# EasyEDA Pro project ProPrj_补光灯_2024-08-31.epro

# Schematic Schematic1
Create Date: 2024-07-06; Page Name: P1; Project Name: 补光灯; Schematic Name: Schematic1; Update Date: 2024-07-06; Company: 嘉立创EDA; Page Size: A4; Version: V1.0
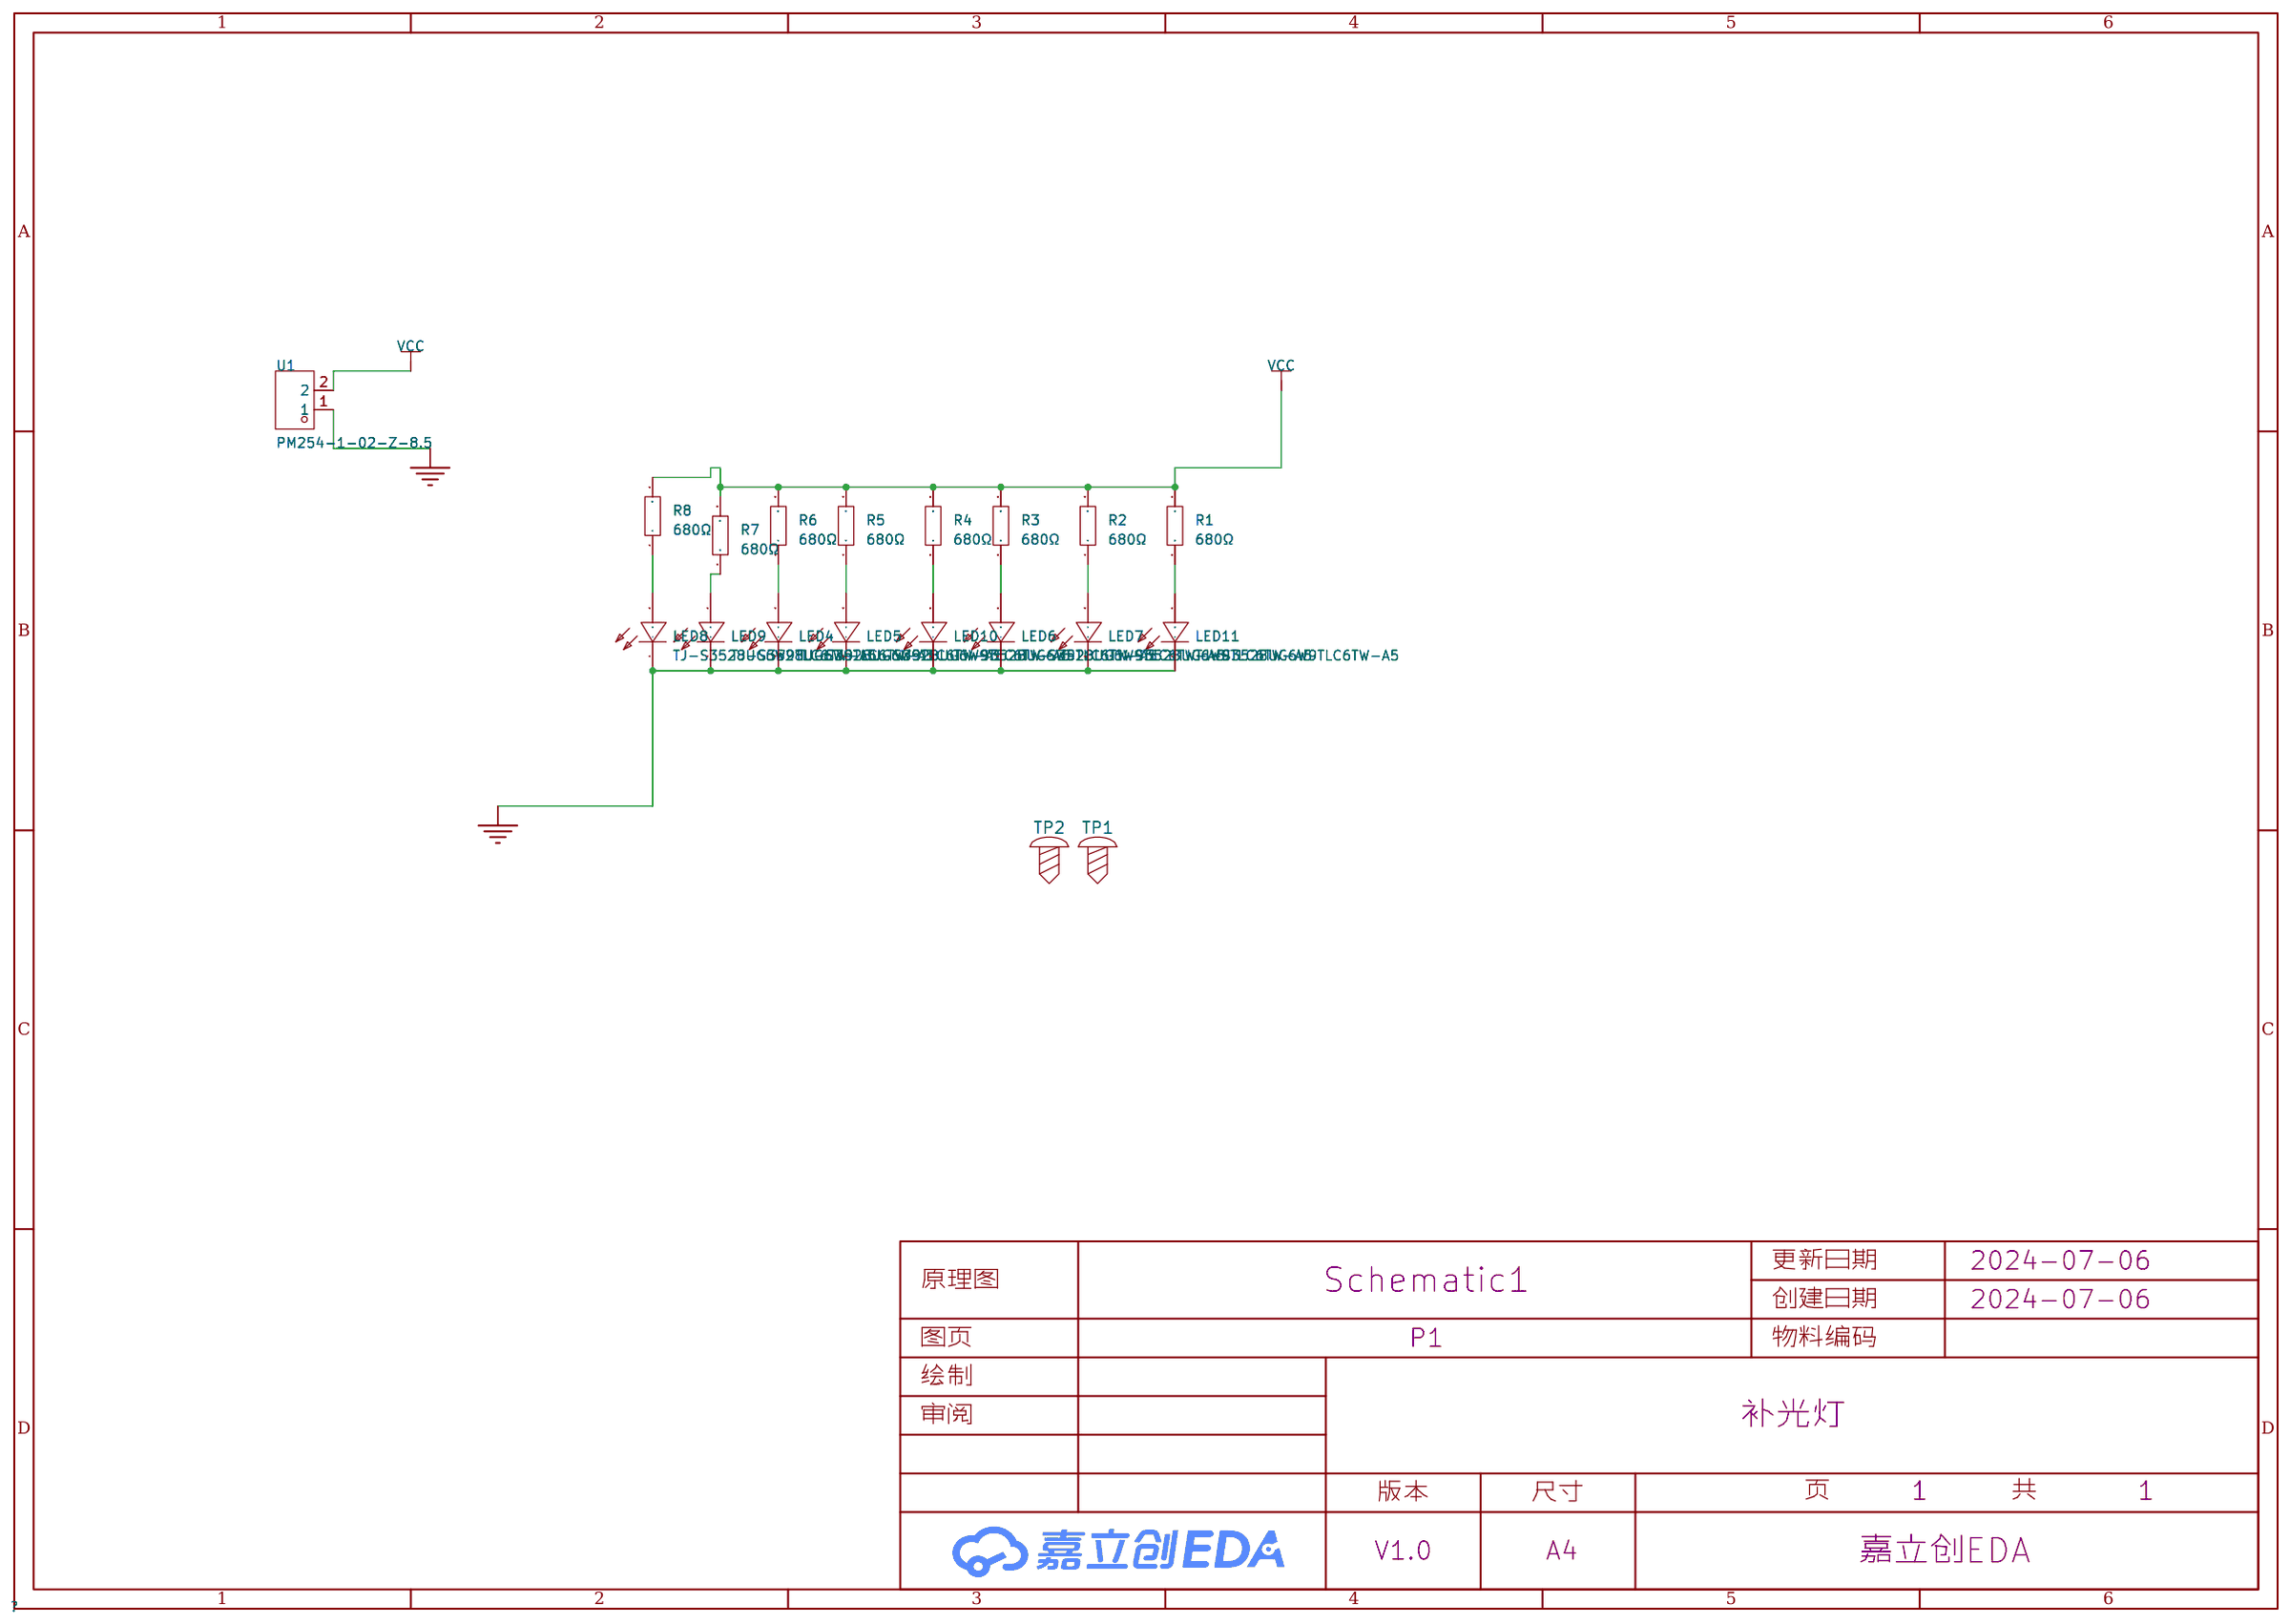
[diagram p0: schematic sheet]

## Parts
LED4  TJ-S3528UG6W9TLC6TW-A5  [LED-SMD_L3.2-W2.8-R-RD]
LED5  TJ-S3528UG6W9TLC6TW-A5  [LED-SMD_L3.2-W2.8-R-RD]
LED6  TJ-S3528UG6W9TLC6TW-A5  [LED-SMD_L3.2-W2.8-R-RD]
LED7  TJ-S3528UG6W9TLC6TW-A5  [LED-SMD_L3.2-W2.8-R-RD]
LED8  TJ-S3528UG6W9TLC6TW-A5  [LED-SMD_L3.2-W2.8-R-RD]
LED9  TJ-S3528UG6W9TLC6TW-A5  [LED-SMD_L3.2-W2.8-R-RD]
LED10  TJ-S3528UG6W9TLC6TW-A5  [LED-SMD_L3.2-W2.8-R-RD]
LED11  TJ-S3528UG6W9TLC6TW-A5  [LED-SMD_L3.2-W2.8-R-RD]
R1  680Ω  [R0805]
R2  680Ω  [R0805]
R3  680Ω  [R0805]
R4  680Ω  [R0805]
R5  680Ω  [R0805]
R6  680Ω  [R0805]
R7  680Ω  [R0805]
R8  680Ω  [R0805]
TP1  M3铜柱带丝印  [M3铜柱]
TP2  M3铜柱带丝印  [M3铜柱]
U1  PM254-1-02-Z-8.5  [HDR-TH_2P-P2.54-V-F]

## Library data of the parts
LED4-LED11 = TJ-S3528UG6W9TLC6TW-A5: 发光颜色:白色;功率:108mW;正向电流:20mA;主波长:-;二极管配置:-;透镜颜色:-;色温:5500K~7000K;发光角度:120°;载带方式:-;工作温度:-40℃~+80℃;; LCSC Part Name: 白灯 色温5500K~7000K; Supplier Part: C440446; Manufacturer: TOGIALED(统佳); Supplier Footprint: SMD3528; JLCPCB Part Class: 扩展库; Datasheet: https://atta.szlcsc.com/upload/public/pdf/source/20191029/C440446_C922C7169113DF60423DD98CE29B74FA.pdf; Supplier: LCSC; Emitted Color: 白色; Power Dissipation: 108mW; Forward Current: 20mA; Color Temperature: 5500K~7000K; Viewing Angle: 120°; Operating Temperature: -40℃~+80℃
R1-R8 = 0805W8F6800T5E: 电阻类型:厚膜电阻;阻值:680Ω;精度:±1%;功率:125mW;最大工作电压:150V;温度系数:±100ppm/℃;; LCSC Part Name: 680Ω ±1% 125mW 厚膜电阻; Supplier Part: C17798; Manufacturer: UNI-ROYAL(厚声); Supplier Footprint: 0805; JLCPCB Part Class: 基础库; Datasheet: https://atta.szlcsc.com/upload/public/pdf/source/20200306/C422600_1E6D84923E4A46A82E41ADD87F860B5C.pdf; Supplier: LCSC; Type: 厚膜电阻; Tolerance: ±1%; Power(Watts): 125mW; Overload Voltage (Max): 150V; Temperature Coefficient: ±100ppm/℃; Operating Temperature Range: -55℃~+155℃
TP1 TP2 = M3铜柱带丝印: Check: false
U1 = PM254-1-02-Z-8.5: 插孔结构:1x2P;间距:2.54mm;行距:-;圆孔/方孔:方孔;安装类型:直插;排数:单排;总孔位数:2P;额定电流:3A;额定电压:-;插孔方向:顶部;塑高:8.5mm;触头材质:铜合金;工作温度范围:-40℃~+105℃;焊接温度(最大值):260℃@5S;; LCSC Part Name: 1x2P 间距:2.54mm 直插; Supplier Part: C2897365; Manufacturer: HCTL(华灿天禄); Supplier Footprint: 插件,P=2.54mm; Datasheet: https://atta.szlcsc.com/upload/public/pdf/source/20230609/534BE42964C679BDE98E061007C4ABD6.pdf; Supplier: LCSC; Holes Structure: 1x2P; Pitch: 2.54mm; Circular Hole / Square Hole: 方孔; Mounting Type: 直插; Number of Rows: 单排; Number of Holes: 2P; Current Rating (Max): 3A; Holes Direction: 顶部; Insulation Height: 8.5mm; Contact Material: 铜合金; Operating Temperature Range: -40℃~+105℃; Soldering Temperature(Max): 260℃@5S

## Nets
GND: LED4.1(-) LED5.1(-) LED6.1(-) LED7.1(-) LED8.1(-) LED9.1(-) LED10.1(-) LED11.1(-) U1.1
VCC: R1.2 R2.2 R3.2 R4.2 R5.2 R6.2 R7.2 R8.2 U1.2
$1N1344: LED8.2(+) R8.1
$1N1355: LED4.2(+) R6.1
$1N1356: LED9.2(+) R7.1
$1N1361: LED5.2(+) R5.1
$1N1364: LED10.2(+) R4.1
$1N1370: LED6.2(+) R3.1
$1N1376: LED7.2(+) R2.1
$1N1379: LED11.2(+) R1.1

# Board PCB1
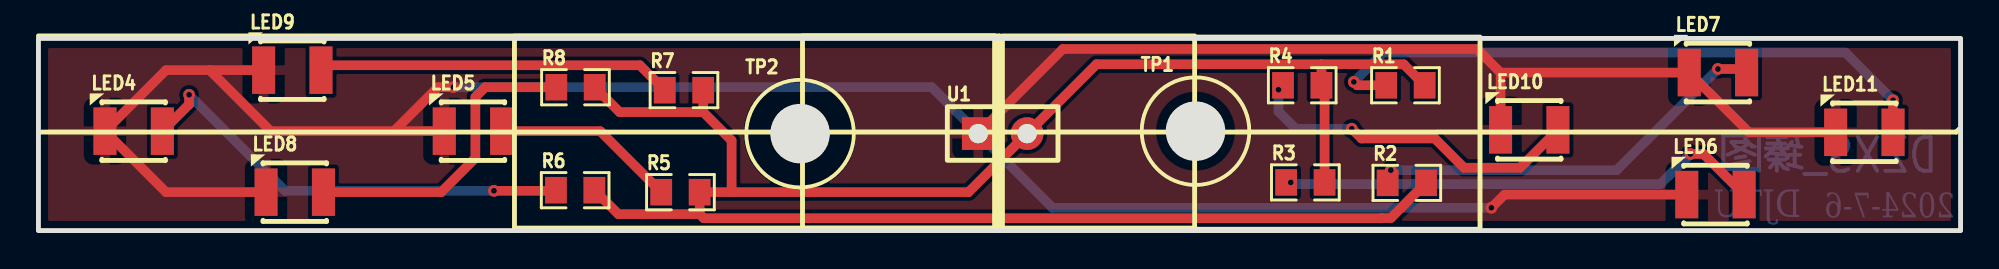
[diagram p1: board, top side]
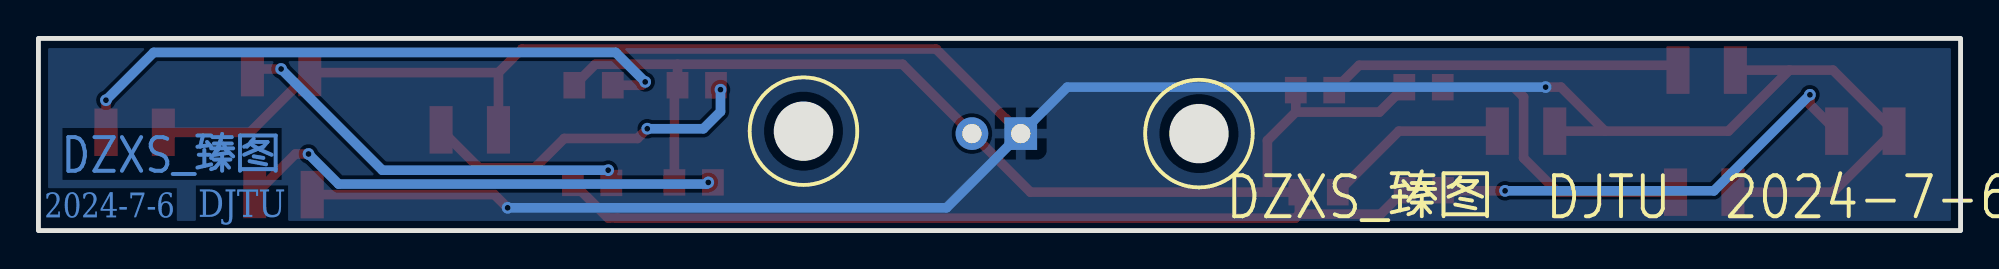
[diagram p2: board, bottom side, seen from below]

Outline 100 x 10 mm; copper layers: Top Layer, Bottom Layer. Coordinates in mm from the lower left corner of the outline.
Outline path: rectangle 0,10 100,0
Stack: Top Layer 0.035mm / Dielectric1 1.51mm FR4 er 4.5 / Bottom Layer 0.035mm

## Design rules (mm)
template: 自定义配置
spacing copperThickness1oz (default): track to track 0.102, other pairs 0.152 to 0.3
spacing copperThickness2oz: track to track 0.203, other pairs 0.152 to 0.3
track width copperThickness1oz (default): min 0.127, default 0.254, max 2.54
track width copperThickness2oz: min 0.203, default 0.254, max 2.54
track width trackWidth1: min 0.5, default 0.5, max 2.54
differential pair differentialPair (default): width min 0.127, default 0.254, max 2.54; gap min 0.152, default 0.152
via viaSize (default): diameter min 0.5, default 0.61, max 10; hole min 0.3, default 0.305, max 6.3

## Placement (name value [footprint] x y rotation side)
LED4  TJ-S3528UG6W9TLC6TW-A5  [LED-SMD_L3.2-W2.8-R-RD]  4.95 5.17 0 top
LED5  TJ-S3528UG6W9TLC6TW-A5  [LED-SMD_L3.2-W2.8-R-RD]  22.61 5.17 0 top
LED6  TJ-S3528UG6W9TLC6TW-A5  [LED-SMD_L3.2-W2.8-R-RD]  87.25 1.87 0 top
LED7  TJ-S3528UG6W9TLC6TW-A5  [LED-SMD_L3.2-W2.8-R-RD]  87.38 8.22 0 top
LED8  TJ-S3528UG6W9TLC6TW-A5  [LED-SMD_L3.2-W2.8-R-RD]  13.34 2 0 top
LED9  TJ-S3528UG6W9TLC6TW-A5  [LED-SMD_L3.2-W2.8-R-RD]  13.21 8.35 0 top
LED10  TJ-S3528UG6W9TLC6TW-A5  [LED-SMD_L3.2-W2.8-R-RD]  77.56 5.24 0 top
LED11  TJ-S3528UG6W9TLC6TW-A5  [LED-SMD_L3.2-W2.8-R-RD]  94.99 5.11 0 top
R1  680Ω  [R0805]  71.12 7.56 0 top
R2  680Ω  [R0805]  71.19 2.48 0 top
R3  680Ω  [R0805]  65.91 2.51 0 top
R4  680Ω  [R0805]  65.75 7.56 0 top
R5  680Ω  [R0805]  33.4 2 0 top
R6  680Ω  [R0805]  27.92 2.1 0 top
R7  680Ω  [R0805]  33.58 7.31 0 top
R8  680Ω  [R0805]  27.94 7.46 0 top
TP1  M3铜柱带丝印  [M3铜柱]  60.2 5.17 0 top
TP2  M3铜柱带丝印  [M3铜柱]  39.62 5.05 0 top
U1  PM254-1-02-Z-8.5  [HDR-TH_2P-P2.54-V-F]  50.17 5.05 0 top

## Footprints (pads in the part's own frame, mm; a bottom-side part is the same pattern mirrored in y, then rotated)
HDR-TH_2P-P2.54-V-F
  rect 1.7x1.7 hole 1: 1(-1.27,0)
  round 1.7 hole 1: 2(1.27,0)
LED-SMD_L3.2-W2.8-R-RD
  rect 1.2x2.47 smd: 1(-1.492,0) 2(1.492,0)
R0805
  rect 1.133x1.377 smd: 1(-1,0) 2(1,0)

## Nets
As in the schematic.

## Via types
v1: diameter 0.61, hole 0.305, Top Layer to Bottom Layer, 12 vias

## Routing (per net, layer and track width the routed paths; a pad name or vN(x,y) marks a point on that pad's centre or on a via; arc(x,y) is an arc through that point)
GND: length 155.1
  Top Layer w0.5: LED11.1 88.99,5.11 LED7.1 76.07,8.22 ; 18.5,5.17 12.08,5.17 8.91,8.35 ; 18.5,5.17 LED5.1 ; 18.5,5.17 20.79,7.47 v1(21.59,7.47) ; LED6.1 76.28,1.87 v1(75.59,1.18) ; 8.91,8.35 6.64,8.35 LED4.1 6.64,2 LED8.1 ; 8.91,8.35 LED9.1 ; 76.07,8.22 LED10.1 ; 76.07,8.22 74.84,9.45 53.3,9.45 U1.1
  Bottom Layer w0.5: v1(21.59,7.47) 46.48,7.47 U1.1 52.76,1.18 v1(75.59,1.18)
VCC: length 105
  Top Layer w0.5: 66.75,8.65 55.04,8.65 U1.2 48.39,2 36.06,2 ; 66.75,8.65 71.03,8.65 R1.2 ; 66.75,8.65 R4.2 66.91,7.4 R3.2 ; 34.4,0.86 R5.2 36.06,2 ; 34.4,0.86 30.17,0.86 R6.2 ; 34.4,0.86 34.61,0.64 69.87,0.64 69.88,0.65 70.36,0.65 R2.2 ; R7.2 34.58,6.17 ; 34.58,6.17 30.23,6.17 R8.2 ; 34.58,6.17 36.06,4.69 36.06,2
$1N1344: length 16.2
  Top Layer w0.5: R8.1 23.24,7.46 22.73,6.95 22.73,3.78 20.95,2 LED8.2
$1N1355: length 23.6
  Top Layer w0.5: v1(7.84,7.07) 7.84,6.56 LED4.2 ; v1(23.7,2.07) 26.89,2.07 R6.1
  Bottom Layer w0.5: v1(23.7,2.07) 12.83,2.07 v1(7.84,7.07)
$1N1356: length 18.5
  Top Layer w0.5: R7.1 31.29,8.6 14.95,8.6 LED9.2
$1N1361: length 9.6
  Top Layer w0.5: R5.1 29.23,5.17 LED5.2
$1N1364: length 18
  Top Layer w0.5: LED10.2 77.08,3.27 74.17,3.27 72.64,4.79 68.83,4.79 v1(68.33,5.3) ; R4.1 64.52,7.33 v1(64.52,7.33)
  Bottom Layer w0.5: v1(64.52,7.33) 64.52,6.19 65.41,5.3 v1(68.33,5.3)
$1N1370: length 25.4
  Top Layer w0.5: v1(85.95,3.99) 86.63,3.99 LED6.2 ; v1(65.15,2.51) R3.1
  Bottom Layer w0.5: v1(65.15,2.51) 65.24,2.42 84.38,2.42 v1(85.95,3.99)
$1N1376: length 21.5
  Top Layer w0.5: LED7.2 88.68,8.41 v1(87.38,8.41) ; R2.1 70.36,2.65 v1(70.36,3.14)
  Bottom Layer w0.5: v1(70.36,3.14) 82.11,3.14 v1(87.38,8.41)
$1N1379: length 33.1
  Top Layer w0.5: v1(68.43,7.74) 68.61,7.56 R1.1 ; LED11.2 v1(96.49,6.79)
  Bottom Layer w0.5: v1(68.43,7.74) 69.97,9.27 94,9.27 v1(96.49,6.79)

## Copper pours and planes (outline as drawn; the poured copper is in the pictures)
GND on Top Layer: -1.91,12.92 102.62,12.92 102.62,-3.34 -1.91,-3.34
GND on Bottom Layer: -4.7,14.57 106.05,14.57 106.05,-7.02 -4.7,-7.02

## Text on the board
Bottom Layer: 2024-7-6 | DJTU | DZXS_臻图
Bottom Silkscreen Layer: DZXS_臻图  DJTU  2024-7-6
